# EAGLE design hub75-Adapter (EAGLE 9.6.2)
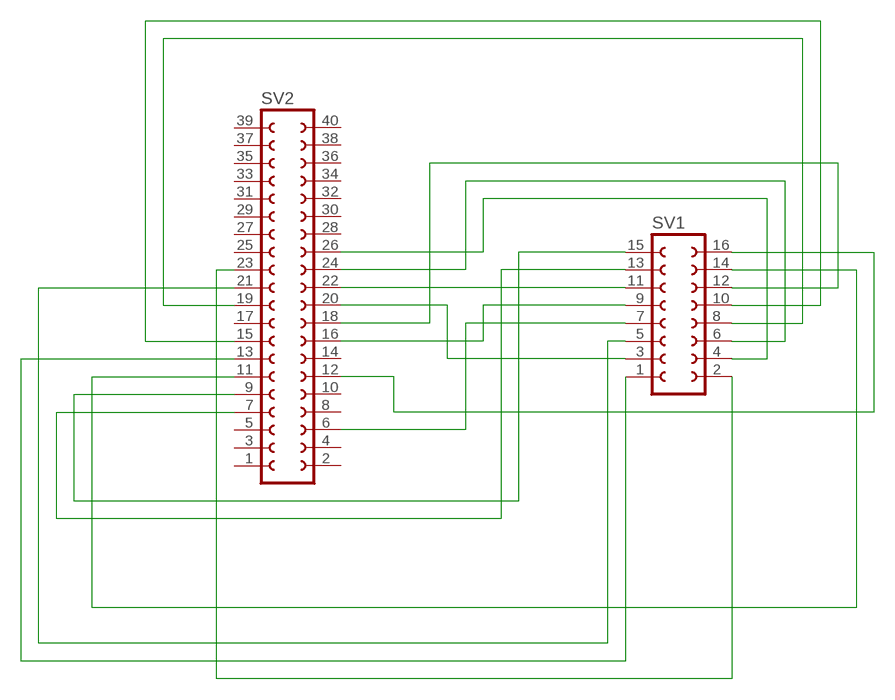
[diagram p0: schematic, sheet 1]

## Parts
SV1  FE08-2  [FE08-2]
SV2  FE20-2  [FE20-2]

## Nets
N$1: SV1.5 SV2.21
N$2: SV1.3 SV2.20
N$3: SV1.8 SV2.19
N$4: SV1.7 SV2.6
N$5: SV1.9 SV2.16
N$6: SV1.11 SV2.22
N$7: SV1.13 SV2.7
N$8: SV1.15 SV2.9
N$9: SV1.2 SV2.23
N$10: SV1.4 SV2.26
N$11: SV1.6 SV2.24
N$12: SV1.10 SV2.15
N$13: SV1.1 SV2.13
N$14: SV1.12 SV2.18
N$15: SV1.14 SV2.11
N$16: SV1.16 SV2.12
Unconnected: SV2.1 SV2.2 SV2.3 SV2.4 SV2.5 SV2.8 SV2.10 SV2.14 SV2.17 SV2.25 SV2.27 SV2.28 SV2.29 SV2.30 SV2.31 SV2.32 SV2.33 SV2.34 SV2.35 SV2.36 SV2.37 SV2.38 SV2.39 SV2.40

## Library data of the parts
SV1 = con-lsta:FE08-2: FEMALE HEADER; OC_FARNELL: unknown; OC_NEWARK: unknown
SV2 = con-lsta:FE20-2: FEMALE HEADER; OC_FARNELL: unknown; OC_NEWARK: unknown

## Board
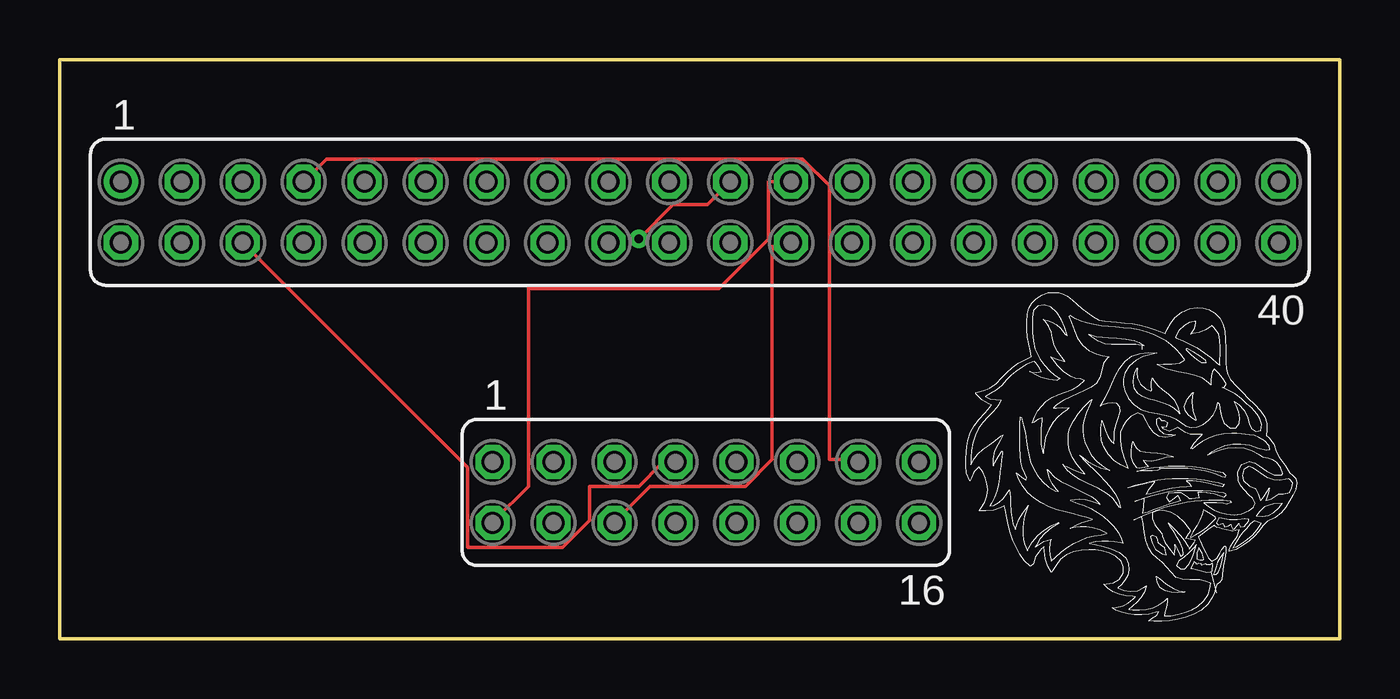
[diagram p1: board, top side]
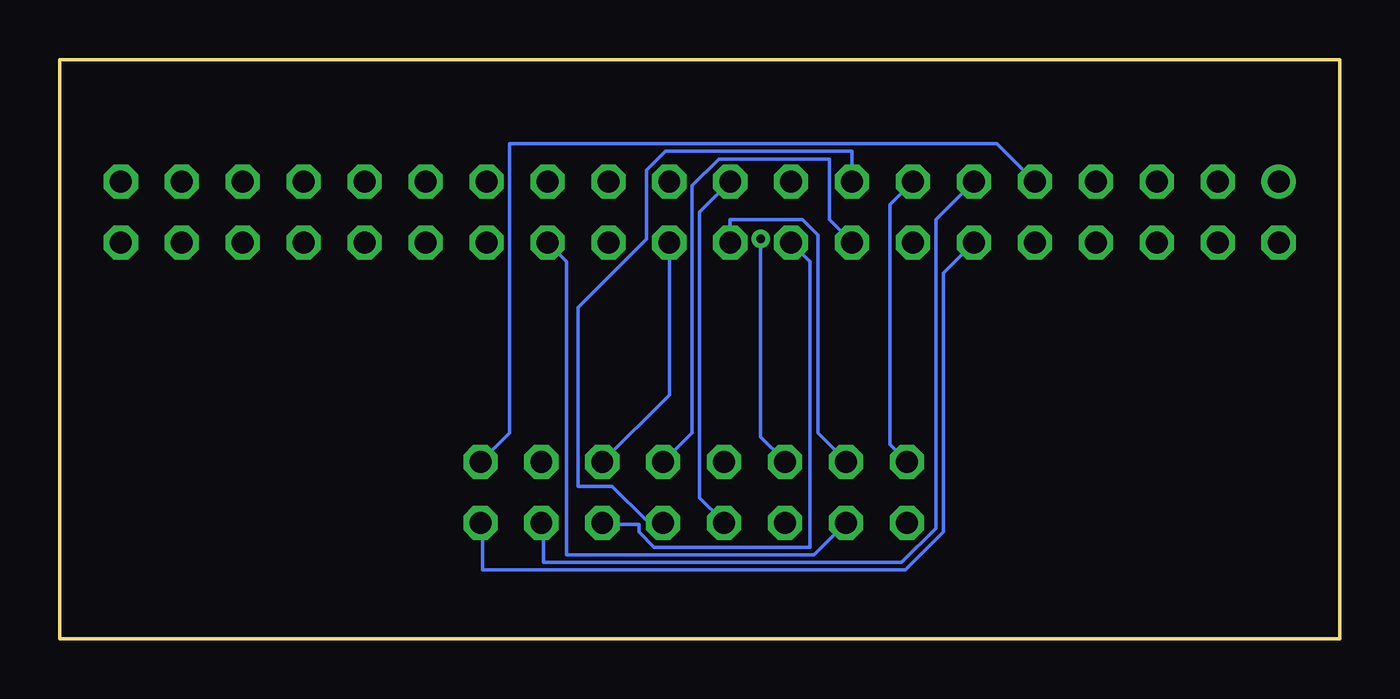
[diagram p2: board, bottom side, seen from below]

Size 53.34 x 24.13 mm. Coordinates in mm from the lower left corner, seen from the top.
Outline: 0,24.13 0,0 53.34,0 53.34,24.13 0,24.13
Copper layers (1*16): Top 0.035mm / dielectric 1.5mm / Bottom 0.035mm
Design rules "default": minimum track width 6mil, minimum drill 0.35mm, track to track 6mil, track to pad 6mil, pad to pad 6mil, via to via 6mil, smd to smd 6mil, copper to edge 40mil, drill to drill 6mil, minimum pad ring 10mil, minimum via ring 8mil, stop-mask expansion 4mil, vias tented up to drill 0mil, thermal gap 10mil

### Footprints (pad centres in the part's own frame; a part is rotated, then mirrored left to right if it is on the bottom)
FE08-2 = drill 0.914 octagon: 1 -8.89,1.27; 2 -8.89,-1.27; 3 -6.35,1.27; 4 -6.35,-1.27; 5 -3.81,1.27; 6 -3.81,-1.27; 7 -1.27,1.27; 8 -1.27,-1.27; 9 1.27,1.27; 10 1.27,-1.27; 11 3.81,1.27; 12 3.81,-1.27; 13 6.35,1.27; 14 6.35,-1.27; 15 8.89,1.27; 16 8.89,-1.27
FE20-2 = drill 0.914: 1 -24.13,1.27 | drill 0.914 octagon: 2 -24.13,-1.27; 3 -21.59,1.27; 4 -21.59,-1.27; 5 -19.05,1.27; 6 -19.05,-1.27; 7 -16.51,1.27; 8 -16.51,-1.27; 9 -13.97,1.27; 10 -13.97,-1.27; 11 -11.43,1.27; 12 -11.43,-1.27; 13 -8.89,1.27; 14 -8.89,-1.27; 15 -6.35,1.27; 16 -6.35,-1.27; 17 -3.81,1.27; 18 -3.81,-1.27; 19 -1.27,1.27; 20 -1.27,-1.27; 21 1.27,1.27; 22 1.27,-1.27; 23 3.81,1.27; 24 3.81,-1.27; 25 6.35,1.27; 26 6.35,-1.27; 27 8.89,1.27; 28 8.89,-1.27; 29 11.43,1.27; 30 11.43,-1.27; 31 13.97,1.27; 32 13.97,-1.27; 33 16.51,1.27; 34 16.51,-1.27; 35 19.05,1.27; 36 19.05,-1.27; 37 21.59,1.27; 38 21.59,-1.27; 39 24.13,1.27; 40 24.13,-1.27

### Placement (x,y rotation side)
SV1  26.92,6.1 0 top
SV2  26.67,17.78 0 top

### Tracks (layer width: path | path; a pad name or v marks a point on that pad's centre or on a via)
N$1  (via drill 0.35)
  Top 0.152: v24.13,16.67 25.56,18.1 26.99,18.1 SV2.21
  Bottom 0.152: v24.13,16.67 24.13,8.41 23.18,7.46 SV1.5
N$2
  Bottom 0.152: SV2.20 25.4,17.46 22.38,17.46 21.75,16.83 21.75,8.57 20.64,7.46 SV1.3
N$3
  Bottom 0.152: SV2.19 26.67,17.78 26.67,5.87 25.72,4.92 SV1.8
N$4
  Top 0.152: SV2.6 16.99,7.14 16.99,3.81 20.95,3.81 22.07,4.92 22.07,6.35 24.13,6.35 25.08,7.3 25.56,7.3 SV1.7
N$5
  Bottom 0.152: SV1.9 26.99,8.57 26.99,18.89 25.88,20 21.27,20 21.27,17.46 SV2.16
N$6
  Bottom 0.152: SV1.11 27.94,10.16 SV2.22
N$7
  Top 0.152: SV2.7 11.11,20 30.96,20 32.07,18.89 32.07,7.46 33.18,7.46 SV1.13
N$8
  Bottom 0.152: SV2.9 14.29,20.64 34.61,20.64 34.61,8.57 SV1.15
N$9
  Top 0.152: SV2.23 29.53,19.05 29.53,16.67 27.46,14.6 19.53,14.6 19.53,6.35 18.1,4.92 SV1.2
N$10
  Bottom 0.152: SV1.4 21.91,3.49 32.23,3.49 32.23,15.72 SV2.26
N$11
  Top 0.152: SV2.24 30.32,16.35 29.69,16.35 29.69,7.46 28.58,6.35 24.61,6.35 23.18,4.92 SV1.6
N$12
  Bottom 0.152: SV2.15 20.32,20.32 28.1,20.32 28.89,19.53 28.89,16.67 31.75,13.81 31.75,6.35 30.32,6.35 28.89,4.92 28.26,4.92 SV1.10
N$13
  Bottom 0.152: SV2.13 18.73,18.1 18.73,8.1 18.1,7.46 SV1.1
N$14
  Bottom 0.152: SV2.18 22.07,15.72 22.07,3.81 28.58,3.81 29.21,4.44 29.21,4.76 30.64,4.76 SV1.12
N$15
  Bottom 0.152: SV2.11 16.83,17.46 16.83,4.6 18.26,3.17 33.18,3.17 33.18,4.76 SV1.14
N$16
  Bottom 0.152: SV2.12 16.51,15.24 16.51,4.44 18.1,2.86 35.72,2.86 35.72,4.76 SV1.16